# EAGLE design Digits-board (EAGLE 9.6.2)
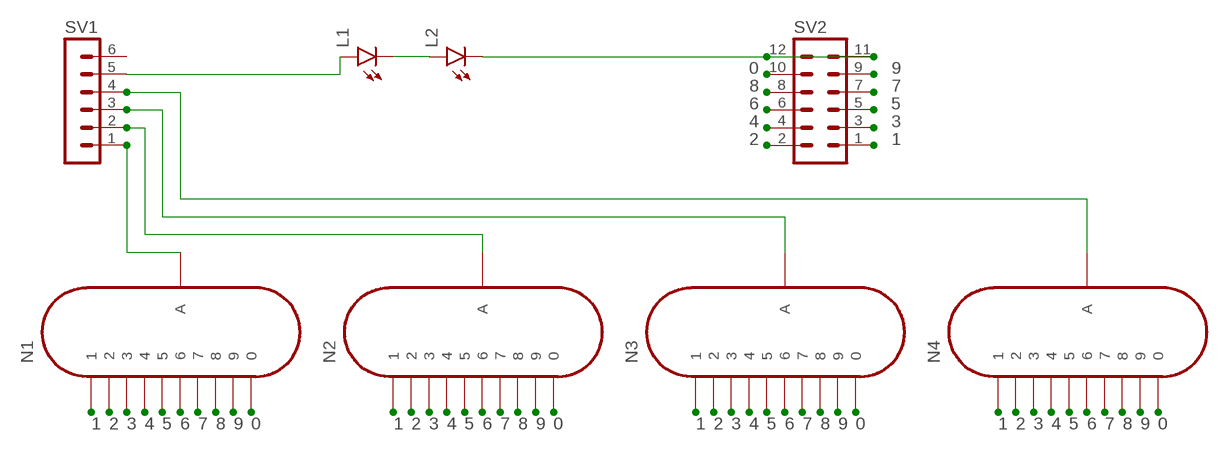
[diagram p0: schematic, sheet 1]

## Parts
L1  LED5MM  [LED5MM]
L2  LED5MM  [LED5MM]
N1  IN-12A  [IN-12]
N2  IN-12A  [IN-12]
N3  IN-12A  [IN-12]
N4  IN-12A  [IN-12]
SV1  MA06-1  [MA06-1]
SV2  MA06-2  [MA06-2]

## Nets
0: N1.0 N2.0 N3.0 N4.0 SV2.10
1: N1.1 N2.1 N3.1 N4.1 SV2.1
2: N1.2 N2.2 N3.2 N4.2 SV2.2
3: N1.3 N2.3 N3.3 N4.3 SV2.3
4: N1.4 N2.4 N3.4 N4.4 SV2.4
5: N1.5 N2.5 N3.5 N4.5 SV2.5
6: N1.6 N2.6 N3.6 N4.6 SV2.6
7: N1.7 N2.7 N3.7 N4.7 SV2.7
8: N1.8 N2.8 N3.8 N4.8 SV2.8
9: N1.9 N2.9 N3.9 N4.9 SV2.9
N$1: L1.K(C) L2.A
N$2: L1.A SV1.5
N$3: N4.A SV1.4
N$4: N3.A SV1.3
N$5: N2.A SV1.2
N$6: N1.A SV1.1
N$14: L2.K(C) SV2.11 SV2.12
Unconnected: SV1.6

## Library data of the parts
L1 L2 = ACES_THT:LED
N1-N4 = russian-nixies:IN-12A: IN-12A: medium numeric topview nixie tube
SV1 = con-lstb:MA06-1: PIN HEADER; OC_FARNELL: unknown; OC_NEWARK: unknown
SV2 = con-lstb:MA06-2: PIN HEADER; OC_FARNELL: unknown; OC_NEWARK: unknown

## Board
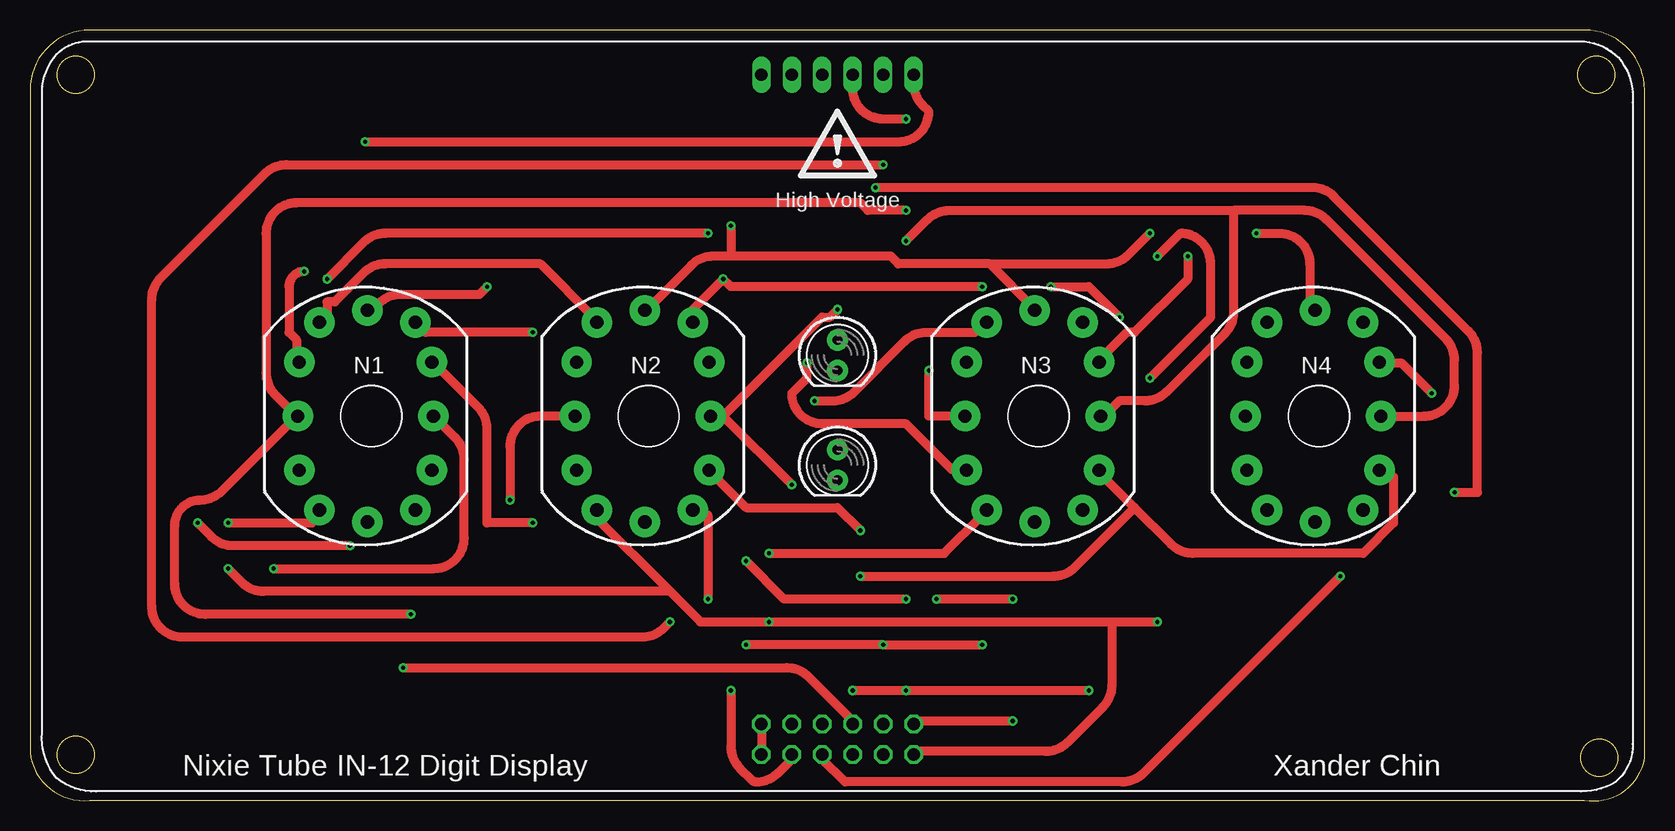
[diagram p1: board, top side]
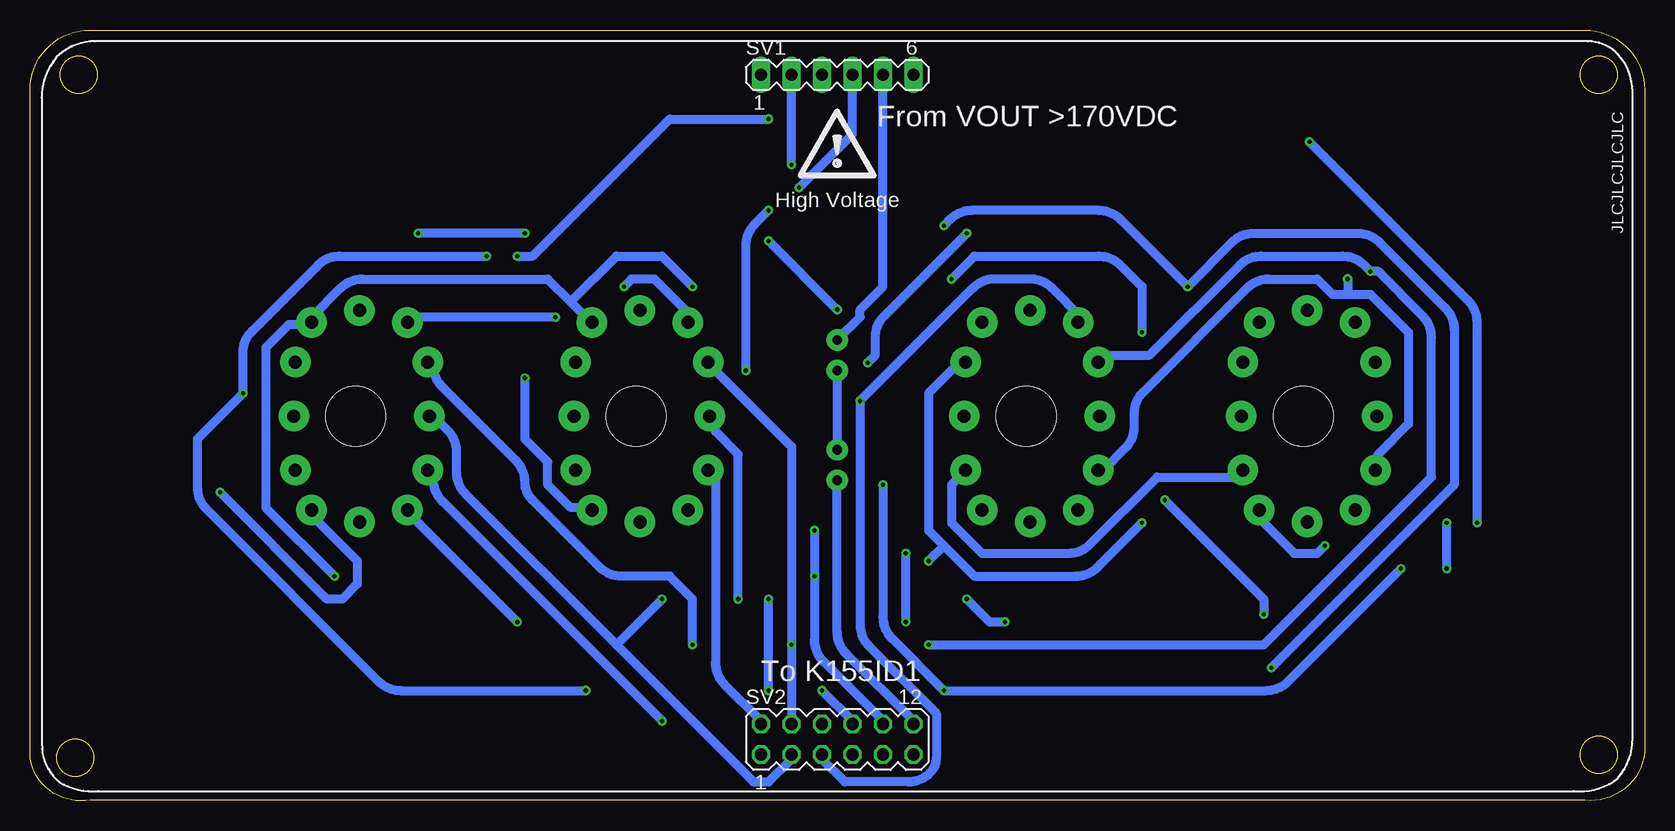
[diagram p2: board, bottom side, seen from below]

Size 134.6 x 64.24 mm. Coordinates in mm from the lower left corner, seen from the top.
Outline: 134.6,3.55 134.6,3.55
Outline: 134.6,3.55 134.6,59.24 arc90 129.6,64.24 5,64.24 arc90 0,59.24 0,4.04 arc90 4.98,0.06 129.58,0.07 arc90 134.6,3.55
Outline: circle at 3.81,60.51 radius 1.55
Outline: circle at 3.81,3.87 radius 1.55
Outline: circle at 130.81,3.61 radius 1.55
Outline: circle at 130.56,60.51 radius 1.55
Copper layers (1*16): Top 0.035mm / dielectric 1.5mm / Bottom 0.035mm
Design rules "ACES_THT *": minimum track width 30mil, minimum drill 0.35mm, track to track 25mil, track to pad 25mil, pad to pad 25mil, via to via 25mil, smd to smd 6mil, copper to edge 40mil, drill to drill 6mil, minimum pad ring 10mil, minimum via ring 8mil, stop-mask expansion 4mil, vias tented up to drill 0mil, thermal gap 10mil

### Footprints (pad centres in the part's own frame; a part is rotated, then mirrored left to right if it is on the bottom)
LED5MM = drill 0.813 pad 1.778: A 0,1.27; K 0,-1.27
IN-12 = drill 1.1 pad 2.54: 0 5.048,-4.5; 1 -4.317,-7.817; 2 -6,-4.5; 3 -6.127,0; 4 -6,4.5; 5 -4.317,7.817; 6 -0.318,8.818; 7 3.683,7.817; 8 5.048,4.5; 9 5.175,0; A 3.683,-7.817; LHDP -0.318,-8.818 | hole 5: 0,0
MA06-1 = drill 1.016 long: 1 -6.35,0; 2 -3.81,0; 3 -1.27,0; 4 1.27,0; 5 3.81,0; 6 6.35,0
MA06-2 = drill 1.016 octagon: 1 -6.35,-1.27; 2 -6.35,1.27; 3 -3.81,-1.27; 4 -3.81,1.27; 5 -1.27,-1.27; 6 -1.27,1.27; 7 1.27,-1.27; 8 1.27,1.27; 9 3.81,-1.27; 10 3.81,1.27; 11 6.35,-1.27; 12 6.35,1.27

### Placement (x,y rotation side)
L1  67.31,37.14 0 top
L2  67.31,28 0 top
N1  28.45,32.06 0 top
N2  51.56,32.06 0 top
N3  84.07,32.06 0 top
N4  107.44,32.06 0 top
SV1  67.31,60.51 0 bottom
SV2  67.31,5.14 0 bottom
U$1  [CAUTION-HIGH-VOLTAGE]  64.77,52.38 0 top
U$2  [CAUTION-HIGH-VOLTAGE]  69.85,52.38 0 bottom

### Tracks (layer width: path | path; a pad name or v marks a point on that pad's centre or on a via)
0  (via drill 0.35)
  Top 0.762: 92.08,24.44 95.14,21.37 arc45 96.94,20.63 111.12,20.63 113.67,23.17 113.67,26.98 113.03,26.98 N4.0 | 92.08,24.44 89.53,26.98 N3.0 | v69.22,22.53 67.31,24.44 59.69,24.44 57.15,26.98 N2.0 | v69.22,18.72 85.31,18.72 arc45 87.1,19.47 92.08,24.44
  Bottom 0.762: v69.22,22.53 v69.22,18.72 69.22,13.43 arc-45 68.47,11.63 63.5,6.66 SV2.10 | N1.0 33.66,26.98 40.64,26.98 46.25,21.37 arc45 48.04,20.63 55.24,20.63 57.78,23.17 57.78,26.34 57.15,26.98 N2.0
1  (via drill 0.35)
  Top 0.762: 90.17,14.91 90.17,9.62 arc-45 89.43,7.82 86.47,4.86 arc-45 84.67,4.12 73.66,4.12 SV2.1 | 90.17,14.91 v61.59,14.91 55.88,14.91 53.34,17.45 | 53.34,17.45 46.99,23.8 N2.1 | v16.51,23.17 23.5,23.17 24.13,23.8 N1.1 | 53.34,17.45 19.47,17.45 arc-45 17.67,18.2 v16.51,19.36 | v61.59,20.63 76.2,20.63 79.38,23.8 N3.1 | 90.17,14.91 v93.98,14.91
  Bottom 0.762: v16.51,19.36 v16.51,23.17 | v61.59,14.91 v61.59,20.63 | v93.98,14.91 102.87,23.8 N4.1
2  (via drill 0.35)
  Top 0.762: v81.92,6.66 73.66,6.66 SV2.2 | v56.52,47.3 29.63,47.3 arc45 27.83,46.56 v24.77,43.49 | v64.77,36.5 64.77,35.23 63.5,33.96 arc90 66.04,31.42 73.03,31.42 76.83,27.61 77.47,27.61 N3.2
  Bottom 0.762: 24.77,42.22 26.04,42.22 27.3,43.49 31.33,43.49 arc-45 33.13,42.75 41.8,34.07 arc-45 42.55,32.28 42.55,31.21 arc45 43.29,29.41 45.09,27.61 N2.2 | 24.77,42.22 22.86,42.22 19.68,39.04 19.68,31.42 22.23,28.88 22.23,27.61 N1.2 | SV2.2 73.66,6.66 76.73,9.73 arc45 77.47,11.52 77.47,26.98 N3.2 | v81.92,6.66 100.22,24.97 arc45 100.97,26.76 100.97,26.98 N4.2 | v24.77,43.49 24.77,42.22 | v56.52,47.3 63.39,40.42 arc-45 64.14,38.63 64.14,37.14 v64.77,36.5
3  (via drill 0.35)
  Top 0.762: 22.23,32.06 15.98,25.82 arc-45 14.19,25.07 arc90 12.06,22.95 12.06,18.09 arc90 14.61,15.55 v31.75,15.55 | N2.3 42.55,32.06 arc90 40.01,29.52 v40.01,25.07 | v81.92,16.82 v75.56,16.82 | 22.23,32.06 20.43,33.86 arc-45 19.68,35.65 19.68,47.3 arc-90 22.23,49.84 69.22,49.84 69.85,49.2 v73.03,49.2 | v74.93,35.87 74.93,32.06 N3.3 | 22.23,32.06 N1.3
  Bottom 0.762: v31.75,15.55 31.75,16.82 v40.01,25.07 | 85.72,13.01 98.32,25.6 arc45 99.06,27.4 99.06,29.1 arc-45 99.8,30.9 100.97,32.06 N4.3 | 85.72,13.01 74.3,1.58 73.03,1.58 71.12,3.48 SV2.3 | v75.56,16.82 75.56,28.88 77.47,30.79 77.47,32.06 N3.3 | 85.72,13.01 v81.92,16.82 | v74.93,35.87 74.93,46.25 arc45 74.19,48.04 v73.03,49.2
4  (via drill 0.35)
  Top 0.762: v22.86,44.12 arc90 21.59,42.85 21.59,39.04 22.23,38.41 22.23,37.14 N1.4 | v79.38,13.01 v71.12,13.01 v59.69,13.01
  Bottom 0.762: N2.4 45.09,37.14 41.27,37.14 33.76,44.65 arc45 31.97,45.39 25.18,45.39 arc45 23.39,44.65 v22.86,44.12 22.23,44.12 18.52,40.42 arc45 17.78,38.63 17.78,26.98 31.75,13.01 v59.69,13.01 | SV2.4 v71.12,13.01 71.12,29.52 78.11,36.5 N3.4 | v79.38,13.01 79.38,16.82 81.28,18.72 85.31,18.72 arc45 87.1,19.47 92.74,25.11 arc45 93.34,26.56 arc-45 94.09,28.36 100.22,34.49 arc45 100.97,36.29 100.97,36.5 N4.4
5  (via drill 0.35)
  Top 0.762: N1.5 24.77,40.31 24.77,41.58 25.4,41.58 27.83,44.02 arc-45 29.63,44.76 42.55,44.76 46.99,40.31 N2.5 | v65.41,33.33 66.89,33.33 arc45 68.69,34.07 72.92,38.3 arc-45 74.71,39.04 78.74,39.04 79.38,39.68 N3.5 | v90.81,40.31 88.27,42.85 v85.09,42.85
  Bottom 0.762: SV2.5 68.58,3.48 66.67,1.58 61.38,1.58 arc-45 59.58,2.32 arc-45 59.05,3.59 59.05,7.29 64.66,12.9 arc45 65.41,14.7 v65.41,33.33 55.99,42.75 arc45 54.19,43.49 51.22,43.49 arc45 49.42,42.75 46.99,40.31 N2.5 | v90.81,40.31 102.87,40.31 N4.5 | v85.09,42.85 84.45,43.49 82.55,43.49 79.38,40.31 N3.5
6  (via drill 0.35)
  Top 0.762: 58.42,45.39 56.93,45.39 arc45 55.14,44.65 51.44,40.95 N2.6 | 58.42,45.39 71.75,45.39 72.39,44.76 80.01,44.76 | 80.01,44.76 83.82,40.95 N3.6 | v102.23,47.3 104.14,47.3 arc-90 106.68,44.76 106.68,40.95 N4.6 | 80.01,44.76 89.75,44.76 arc45 91.55,45.5 v93.34,47.3 | v31.11,11.1 63.08,11.1 arc-45 64.88,10.36 68.58,6.66 SV2.6 | v38.1,42.85 37.47,42.22 30.9,42.22 arc45 29.1,41.48 28.57,40.95 N1.6 | v58.42,47.93 58.42,45.39
  Bottom 0.762: v93.34,47.3 v102.23,47.3 | v31.11,11.1 15.88,26.34 15.88,39.26 arc-45 16.62,41.06 22.12,46.56 arc-45 23.91,47.3 32.6,47.3 arc-45 34.4,46.56 v38.1,42.85 43.71,48.46 arc-45 45.5,49.2 56.1,49.2 arc-45 57.89,48.46 v58.42,47.93
7  (via drill 0.35)
  Top 0.762: v41.91,39.04 33.02,39.04 32.38,39.68 N1.7 | N2.7 54.61,40.31 v57.78,43.49 58.42,42.85 v79.38,42.85 | v109.22,18.72 92.82,2.32 arc-45 91.02,1.58 67.94,1.58 66.04,3.48 SV2.7
  Bottom 0.762: v41.91,39.04 41.91,42.85 43.71,44.65 arc-45 45.5,45.39 55.88,45.39 v57.78,43.49 | v109.22,18.72 114.94,24.44 114.94,37.77 113.03,39.68 111.12,39.68 N4.7 111.12,40.31 108.69,42.75 arc45 106.9,43.49 91.44,43.49 89.53,41.58 | 89.53,41.58 88.27,40.31 N3.7 | v79.38,42.85 81.92,45.39 85.72,45.39 89.53,41.58
8  (via drill 0.35)
  Top 0.762: v41.91,23.17 38.1,23.17 38.1,31.01 arc45 37.36,32.8 33.66,36.5 N1.8 | v88.27,9.2 v73.03,9.2 v68.58,9.2 | v116.84,33.96 114.3,36.5 113.03,36.5 N4.8 | v96.52,45.39 96.52,43.49 92.08,39.04 91.44,39.04 89.53,37.14 N3.8 | v59.69,19.99 62.87,16.82 v73.03,16.82
  Bottom 0.762: v41.91,23.17 45.61,19.47 arc45 47.41,18.72 55.88,18.72 58.42,21.26 | 58.42,21.26 59.69,22.53 59.69,33.96 57.15,36.5 N2.8 | v68.58,9.2 66.04,6.66 SV2.8 | v88.27,9.2 103.72,9.2 arc45 105.52,9.94 119.91,24.33 arc45 120.65,26.13 120.65,30.15 v116.84,33.96 116.84,37.36 arc45 116.1,39.15 110.6,44.65 arc45 108.8,45.39 v96.52,45.39 | v59.69,19.99 58.42,21.26 | v73.03,9.2 v73.03,16.82
9  (via drill 0.35)
  Top 0.762: 100.33,49.2 100.33,40.73 arc-45 99.59,38.94 94.72,34.07 arc-45 92.93,33.33 90.81,33.33 89.53,32.06 N3.9 | N4.9 116.2,32.06 arc90 118.75,34.6 118.75,36.72 arc45 118,38.52 108.06,48.46 arc45 106.26,49.2 100.33,49.2 | v58.42,9.2 58.42,4.54 arc45 59.16,2.74 60.17,1.73 arc45 60.54,1.58 arc45 62.34,2.32 63.5,3.48 SV2.9 | 57.78,32.06 v63.5,26.34 | 57.78,32.06 N2.9 57.15,32.06 | v20.32,19.36 33.66,19.36 arc90 36.2,21.9 36.2,28.47 arc45 35.45,30.26 33.66,32.06 N1.9 | v73.03,46.66 74.82,48.46 arc-45 76.62,49.2 100.33,49.2 | v67.31,40.95 66.67,40.31 66.04,40.31 57.78,32.06
  Bottom 0.762: v63.5,26.34 63.5,15.33 arc-45 62.76,13.54 v58.42,9.2 31.53,9.2 arc-45 29.74,9.94 v20.32,19.36 | v67.31,40.95 v73.03,46.66
N$1
  Bottom 0.762: L1.K L2.A
N$2
  Bottom 0.762: SV1.5 63.5,42.85 65.41,40.95 65.41,40.31 L1.A
N$3  (via drill 0.35)
  Top 0.762: v70.48,51.11 106.9,51.11 arc-45 108.69,50.37 119.91,39.15 arc-45 120.65,37.36 120.65,25.71 v118.75,25.71
  Bottom 0.762: SV1.4 66.04,55.55 v70.48,51.11 | v118.75,25.71 109.86,16.82 108.58,16.82 107.31,18.09 107.31,19.99 111.12,23.8 N4.A
N$4  (via drill 0.35)
  Top 0.762: v73.03,56.82 71.12,56.82 arc-90 68.58,59.36 SV1.3 | v93.98,45.39 95.89,47.3 arc-90 98.42,44.76 98.42,40.31 v93.34,35.23
  Bottom 0.762: v73.03,56.82 81.28,56.82 92.71,45.39 v93.98,45.39 | v93.34,35.23 93.34,30.15 91.44,28.25 91.44,26.34 89.53,24.44 88.27,24.44 N3.A
N$5  (via drill 0.35)
  Top 0.762: v71.12,53.01 21.37,53.01 arc45 19.58,52.27 10.9,43.6 arc45 10.16,41.8 10.16,16.18 arc90 12.7,13.64 51.02,13.64 arc45 52.81,14.39 v53.34,14.91 | v56.52,16.82 56.52,23.8 55.24,23.8 N2.A
  Bottom 0.762: v71.12,53.01 SV1.2 | v53.34,14.91 54.61,14.91 v56.52,16.82
N$6  (via drill 0.35)
  Top 0.762: SV1.1 73.66,59.78 arc45 74.4,57.99 74.93,57.46 arc-90 72.39,54.92 v27.94,54.92 | v26.67,21.26 16.93,21.26 arc-45 15.13,22.01 v13.97,23.17
  Bottom 0.762: v13.97,23.17 13.97,39.9 arc-45 14.71,41.69 v27.94,54.92 | v26.67,21.26 27.3,20.63 29.21,20.63 32.38,23.8 N1.A
N$14
  Top 0.762: SV2.12 SV2.11
  Bottom 0.762: L2.K 67.31,14.06 arc-45 66.57,12.27 60.96,6.66 SV2.12

### Text on the board
_tsilk: Nixie Tube IN-12 Digit Display | Xander Chin
_bsilk: JLCJLCJLCJLC | From VOUT >170VDC | To K155ID1